# Altium schematic sheet Temporizador_V8_top.SchDoc
size A4; SheetNumber: 1; SheetTotal: 9
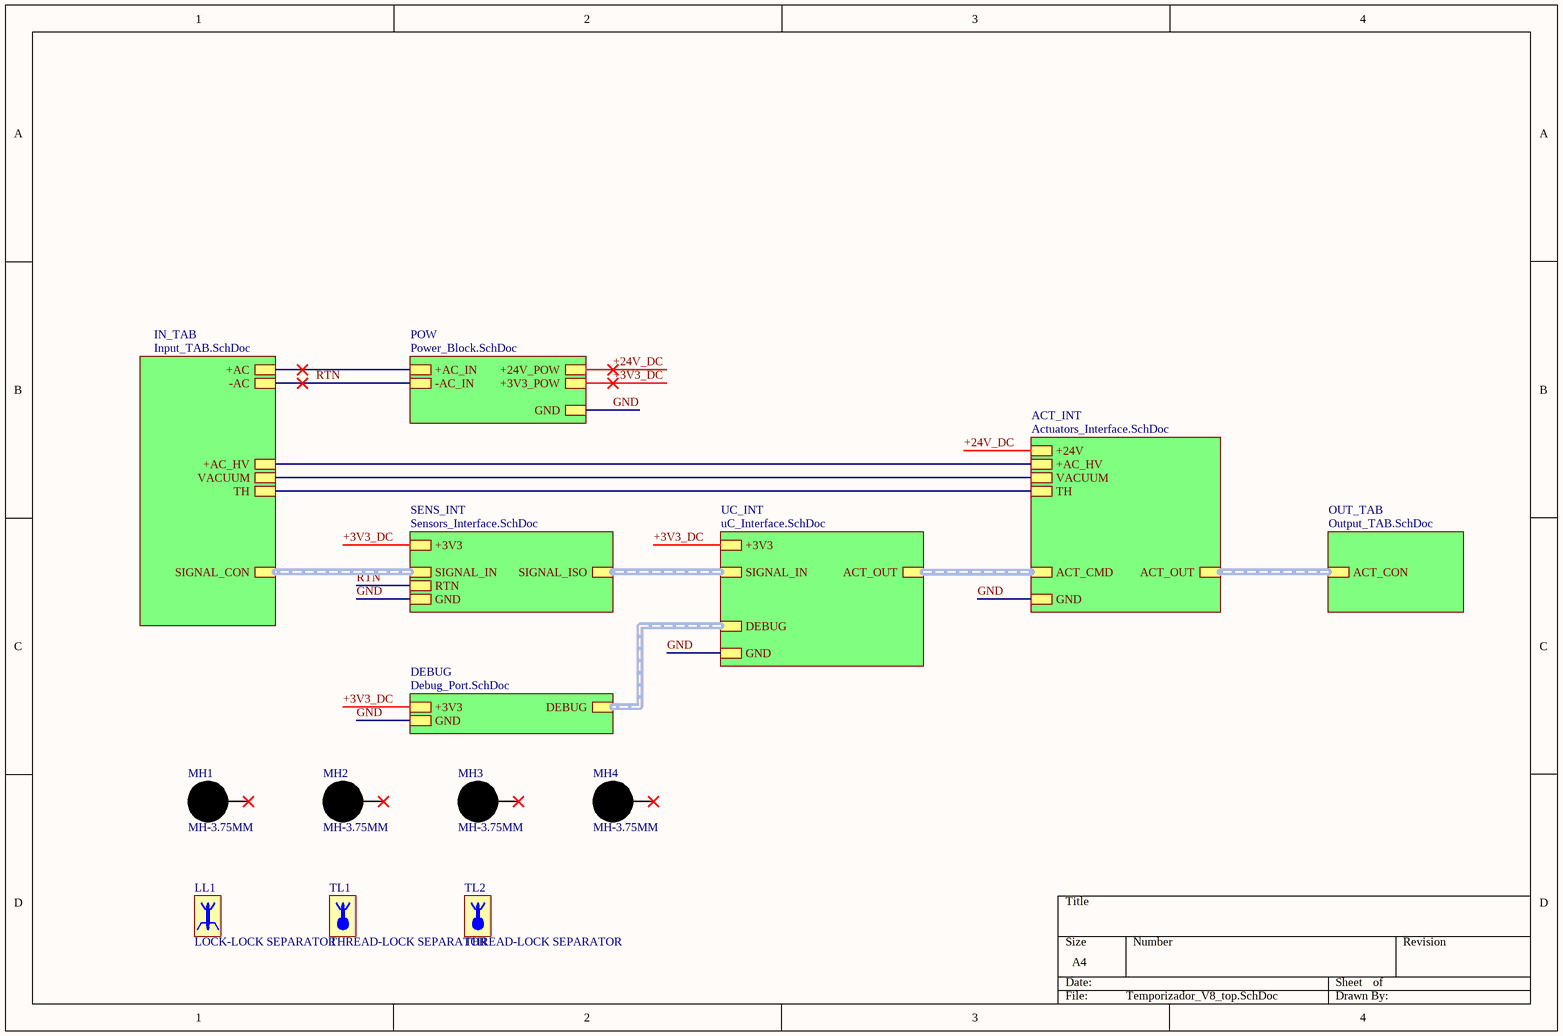
[diagram p0: Temporizador_V8_top.SchDoc]

## Parts
LL1  LOCK-LOCK SEPARATOR  (mechanical)
MH1  MH-3.75MM  [MH-3.75mm-NP]  (no BOM)
MH2  MH-3.75MM  [MH-3.75mm-NP]  (no BOM)
MH3  MH-3.75MM  [MH-3.75mm-NP]  (no BOM)
MH4  MH-3.75MM  [MH-3.75mm-NP]  (no BOM)
TL1  THREAD-LOCK SEPARATOR  (mechanical)
TL2  THREAD-LOCK SEPARATOR  (mechanical)

## Sub-sheets
ACT_INT = Actuators_Interface.SchDoc: ACT_CMD (harness ACT_OUT), +24V, GND, +AC_HV, ACT_OUT (harness ACT_OUT), TH, VACUUM
DEBUG = Debug_Port.SchDoc: DEBUG (harness DEBUG), GND, +3V3
IN_TAB = Input_TAB.SchDoc: +AC_HV, +AC, SIGNAL_CON (harness SIGNAL_BUS), -AC, VACUUM, TH
OUT_TAB = Output_TAB.SchDoc: ACT_CON (harness ACT_OUT)
POW = Power_Block.SchDoc: +AC_IN, -AC_IN, +3V3_POW, +24V_POW, GND
SENS_INT = Sensors_Interface.SchDoc: SIGNAL_ISO (harness SIGNAL_BUS), SIGNAL_IN (harness SIGNAL_BUS), +3V3, GND, RTN
UC_INT = uC_Interface.SchDoc: SIGNAL_IN (harness SIGNAL_BUS), ACT_OUT (harness ACT_OUT), GND, +3V3, DEBUG (harness DEBUG)

## Nets
+3V3_DC: sheet POW/+3V3_POW, sheet SENS_INT/+3V3, sheet UC_INT/+3V3, sheet DEBUG/+3V3
+24V_DC: sheet POW/+24V_POW, sheet ACT_INT/+24V
GND: sheet POW/GND, sheet ACT_INT/GND, sheet SENS_INT/GND, sheet UC_INT/GND, sheet DEBUG/GND
RTN: sheet POW/-AC_IN, sheet IN_TAB/-AC, sheet SENS_INT/RTN
(unnamed): sheet POW/+AC_IN, sheet IN_TAB/+AC
(unnamed): sheet ACT_INT/+AC_HV, sheet IN_TAB/+AC_HV
(unnamed): sheet ACT_INT/TH, sheet IN_TAB/TH
(unnamed): sheet ACT_INT/VACUUM, sheet IN_TAB/VACUUM

Not connected (* = marked no-connect by the designer): MH1 1*; MH2 1*; MH3 1*; MH4 1*

## Buses and harness runs
harness sheet ACT_INT/ACT_CMD = sheet UC_INT/ACT_OUT
harness sheet ACT_INT/ACT_OUT = sheet OUT_TAB/ACT_CON
harness sheet DEBUG/DEBUG = sheet UC_INT/DEBUG
harness sheet IN_TAB/SIGNAL_CON = sheet SENS_INT/SIGNAL_IN
harness sheet SENS_INT/SIGNAL_ISO = sheet UC_INT/SIGNAL_IN

## Library data of the parts
LL1 = LOCK-LOCK SEPARATOR: Separator Lock-Lock 6.4mm
TL1 TL2 = THREAD-LOCK SEPARATOR: Separator Thread-Lock 9.5mm
MH1-MH4 = MH-3.75MM: ClassName: MountHole